# Altium schematic sheet HPW_Protect_SBC.SchDoc: =SheetTitle
size A4; SheetTitle: High-power Bus Protection; DrawnBy: Samyar Sadat Akhavi; SheetNumber: 15; SheetTotal: 19
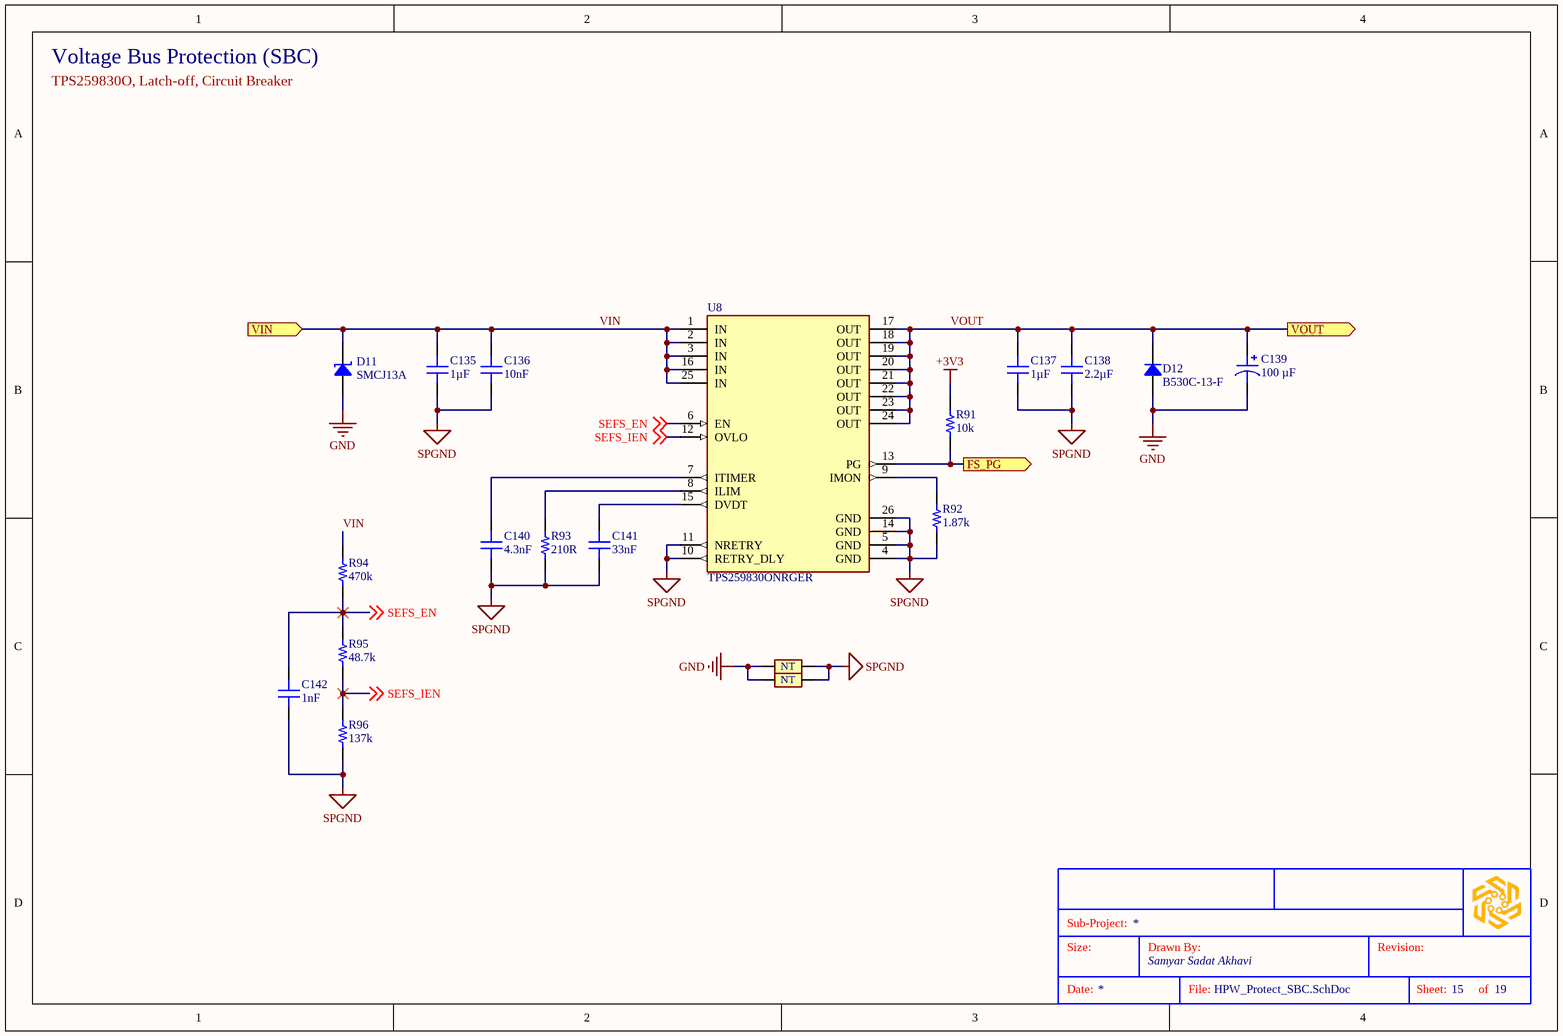
[diagram p0: HPW_Protect_SBC.SchDoc]

## Parts
?  (no value)  (graphical)
C135  1µF  [CAP 0603_1608]
C136  10nF  [CAP 0603_1608]
C137  1µF  [CAP 0603_1608]
C138  2.2µF  [CAP 0805_2012]
C139  100 µF  [CAP ALSMD 6.6MM H7.7MM]
C140  4.3nF  [CAP 0603_1608]
C141  33nF  [CAP 0603_1608]
C142  1nF  [CAP 0603_1608]
D11  SMCJ13A  [DO214AB SMC]
D12  B530C-13-F  [DO214AB SMC]
NT12  Net Tie  [Net_Tie_Via]  (value not drawn)  (net tie, no BOM)
NT13  Net Tie  [Net_Tie_Via]  (value not drawn)  (net tie, no BOM)
R91  10k  [RES 0603_1608]
R92  1.87k  [RES 0603_1608]
R93  210R  [RES 0603_1608]
R94  470k  [RES 0603_1608]
R95  48.7k  [RES 0603_1608]
R96  137k  [RES 0603_1608]
U8  TPS259830ONRGER  [VQFN24_RGE_TEX]

## Ports
FS_PG (out, see Voltage_Regulators[3A]), VIN (in, see Voltage_Regulators[2A]), VOUT (out, see Voltage_Regulators[3A])

## Nets
+3V3: R91.1
GND: C139.2 D11.1 D12.1 NT12.1 NT13.1
SPGND: C135.1 C136.2 C137.1 C138.1 C140.1 C141.1 C142.1 NT12.2 NT13.2 R92.1 R93.1 R96.1 U8.4(GND) U8.5(GND) U8.10(RETRY_DLY) U8.11(NRETRY) U8.14(GND) U8.26(GND)
FS_PG: R91.2 U8.13(PG) ; port FS_PG
SEFS_EN: C142.2 R94.1 R95.2 U8.6(EN) ; off-sheet SEFS_EN
SEFS_IEN: R95.1 R96.2 U8.12(OVLO) ; off-sheet SEFS_IEN
VIN: C135.2 C136.1 D11.2 R94.2 U8.1(IN) U8.2(IN) U8.3(IN) U8.16(IN) U8.25(IN) ; port VIN
VOUT: C137.2 C138.2 C139.1 D12.2 U8.17(OUT) U8.18(OUT) U8.19(OUT) U8.20(OUT) U8.21(OUT) U8.22(OUT) U8.23(OUT) U8.24(OUT) ; port VOUT
NetC140_2: C140.2 U8.7(ITIMER)
NetC141_2: C141.2 U8.15(DVDT)
NetR92_2: R92.2 U8.9(IMON)
NetR93_2: R93.2 U8.8(ILIM)

## Notes on the sheet
- Voltage Bus Protection (SBC)
- TPS259830O, Latch-off, Circuit Breaker
- Sub-Project:
- Size:
- Drawn By:
- Revision:
- Date:
- File:
- Sheet:
- of
- (in symbol GEN-PCBVINT0S3) NT

## Library data of the parts
? = SGR-STDTBSA4: STANDARD SCHEMATICS TITLE BLOCK
C135 C137 = GEN-CC1UT10V25KX7R603: GENERIC 0603 MLC CAPACITOR; Tolerance: ±10%; Voltage: 25V; Dielectric: X7R; Part Number: GEN-CC1UT10V25KX7R603; Value: 1µF
C136 = GEN-CC10NT10V50KX7R603: GENERIC 0603 MLC CAPACITOR; Tolerance: ±10%; Voltage: 50V; Dielectric: X7R; Part Number: GEN-CC10NT10V50KX7R603; Value: 10nF
C138 = GEN-CC2U2T10V25KX7R805: GENERIC 0805 MLC CAPACITOR; Tolerance: ±10%; Voltage: 25V; Dielectric: X7R; Part Number: GEN-CC2U2T10V25KX7R805; Value: 2.2µF
C139 = 865080445010: CAP ALUM 100UF 20% 25V SMD; manufacturer: Würth Elektronik; Impedance: 380 mOhms; Lifetime @ Temp.: 2000 Hrs @ 105°C; Polarization: Polar; Ripple Current @ High Frequency: 290 mA @ 100 kHz; Ripple Current @ Low Frequency: 188.5 mA @ 120 Hz; Surface Mount Land Size: 0.260" L x 0.260" W (6.60mm x 6.60mm); Part Number: 865080445010; Applications: General Purpose; Capacitance: 100 µF; componentlink1description: Datasheet; componentlink1url: https://katalog.we-online.de/pbs/datasheet/865080445010.pdf; componentlink2description: DigiKey Link; componentlink2url: https://www.digikey.com/en/products/detail/würth-elektronik/865080445010/5728033; Device Package: Radial, Can - SMD; Height - Seated (Max): 0.303" (7.70mm); lastupdated: 4/5/2026 8:54:41 PM; Lifecycle Status: Active; Minimum Order: 1; Mounting Type: Surface Mount; Operating Temperature: -55°C ~ 105°C; Package / Case: Radial, Can - SMD; packaging: TapeAndReel; partid: 8228; Part Status: Active; price: 0.16; series: WCAP-ASLI; Size / Dimension: 0.248" Dia (6.30mm); Supplier 1: DigiKey; Supplier Part Number 1: 732-8438-1-ND; Tolerance: ±20%; value: 100 µF; Voltage - Rated: 25 V
C140 = GEN-CC4N3T5V50KC0G603: GENERIC 0603 MLC CAPACITOR; Tolerance: ±5%; Voltage: 50V; Dielectric: C0G; Part Number: GEN-CC4N3T5V50KC0G603; Value: 4.3nF
C141 = GEN-CC33NT5V25KX7R603: GENERIC 0603 MLC CAPACITOR; Tolerance: ±5%; Voltage: 25V; Dielectric: X7R; Part Number: GEN-CC33NT5V25KX7R603; Value: 33nF
C142 = GEN-CC1NT10V16KX7R603: GENERIC 0603 MLC CAPACITOR; Tolerance: ±10%; Voltage: 16V; Dielectric: X7R; Part Number: GEN-CC1NT10V16KX7R603; Value: 1nF
D11 = SMCJ13A: TVS DIODE 13VWM 21.5VC DO214AB; Manufacturer: Littelfuse Inc.; Current - Peak Pulse (10/1000µs): 69.8A; Power Line Protection: No; Power - Peak Pulse: 1500W (1.5kW); Type: Zener; Unidirectional Channels: 1; Voltage - Breakdown (Min): 14.4V; Voltage - Clamping (Max) @ Ipp: 21.5V; Voltage - Reverse Standoff (Typ): 13V; Part Number: SMCJ13A; Applications: General Purpose; ComponentLink1Description: Datasheet; ComponentLink1URL: https://www.littelfuse.com/products/tvs-diodes/surface-mount/~/media/electronics/datasheets/tvs_diodes/littelfuse_tvs_diode_smcj_datasheet.pdf.pdf; ComponentLink2Description: DigiKey Link; ComponentLink2URL: https://www.digikey.com/en/products/detail/littelfuse-inc/SMCJ13A/762378; LastUpdated: 4/5/2026 8:33:56 PM; Lifecycle Status: Active; Minimum Order: 1; Mounting Type: Surface Mount; Operating Temperature: -55°C ~ 150°C (TJ); Package / Case: DO-214AB, SMC; Packaging: TapeAndReel; PartId: 6718; Part Status: Active; Price: 0.16; Series: SMCJ; Supplier 1: DigiKey; Supplier Part Number 1: SMCJ13ALFCT-ND; Supplier Device Package: DO-214AB (SMCJ)
D12 = B530C-13-F: DIODE SCHOTTKY 30V 5A SMC; Manufacturer: Diodes Incorporated; Capacitance @ Vr, F: 300pF @ 4V, 1MHz; Current - Reverse Leakage @ Vr: 500 µA @ 30 V; Speed: Fast Recovery =< 500ns, > 200mA (Io); Voltage - Forward (Vf) (Max) @ If: 550 mV @ 5 A; Part Number: B530C-13-F; ComponentLink1Description: Datasheet; ComponentLink1URL: https://www.diodes.com/assets/Datasheets/ds13012.pdf; ComponentLink2Description: DigiKey Link; ComponentLink2URL: https://www.digikey.com/en/products/detail/diodes-incorporated/B530C-13-F/768770; Current - Average Rectified (Io): 5A; Diode Type: Schottky; LastUpdated: 4/5/2026 8:31:14 PM; Lifecycle Status: Active; Minimum Order: 1; Mounting Type: Surface Mount; Operating Temperature - Junction: -55°C ~ 150°C; Package / Case: DO-214AB, SMC; Packaging: CutTape; PartId: 1719; Part Status: Active; Price: 0.30; Series: -; Supplier 1: DigiKey; Supplier Part Number 1: B530C-FDICT-ND; Supplier Device Package: SMC; Voltage - DC Reverse (Vr) (Max): 30 V
NT12 NT13 = GEN-PCBVINT0S3: VIA STYLE CIRCULAR NET TIE; Part Number: GEN-PCBVINT0S3; Size Variant: 0.3mm
R91 = GEN-CRR10KT1P8603: GENERIC 0603 CHIP RESISTOR; Tolerance: ±1%; Power: 0.125W; Part Number: GEN-CRR10KT1P8603; Value: 10k
R92 = GEN-CRR1K87T1P8603: GENERIC 0603 CHIP RESISTOR; Tolerance: ±1%; Power: 0.125W; Part Number: GEN-CRR1K87T1P8603; Value: 1.87k
R93 = GEN-CRR210T1P8603: GENERIC 0603 CHIP RESISTOR; Tolerance: ±1%; Power: 0.125W; Part Number: GEN-CRR210T1P8603; Value: 210R
R94 = GEN-CRR470KT1P8603: GENERIC 0603 CHIP RESISTOR; Tolerance: ±1%; Power: 0.125W; Part Number: GEN-CRR470KT1P8603; Value: 470k
R95 = GEN-CRR48K7T1P8603: GENERIC 0603 CHIP RESISTOR; Tolerance: ±1%; Power: 0.125W; Part Number: GEN-CRR48K7T1P8603; Value: 48.7k
R96 = GEN-CRR137KT1P8603: GENERIC 0603 CHIP RESISTOR; Tolerance: ±1%; Power: 0.125W; Part Number: GEN-CRR137KT1P8603; Value: 137k
U8 = TPS259830ONRGER: 2.7-V TO 26-V, 2.7-M 18-A INTEGR; Manufacturer: Texas Instruments; Copyright: Copyright (C) 2025 Ultra Librarian. All rights reserved.; Part Number: TPS259830ONRGER; Supplier 1: DigiKey; Supplier Part Number 1: 296-TPS259830ONRGERCT-ND